# EAGLE schematic TwixBC (EAGLE 5.06)
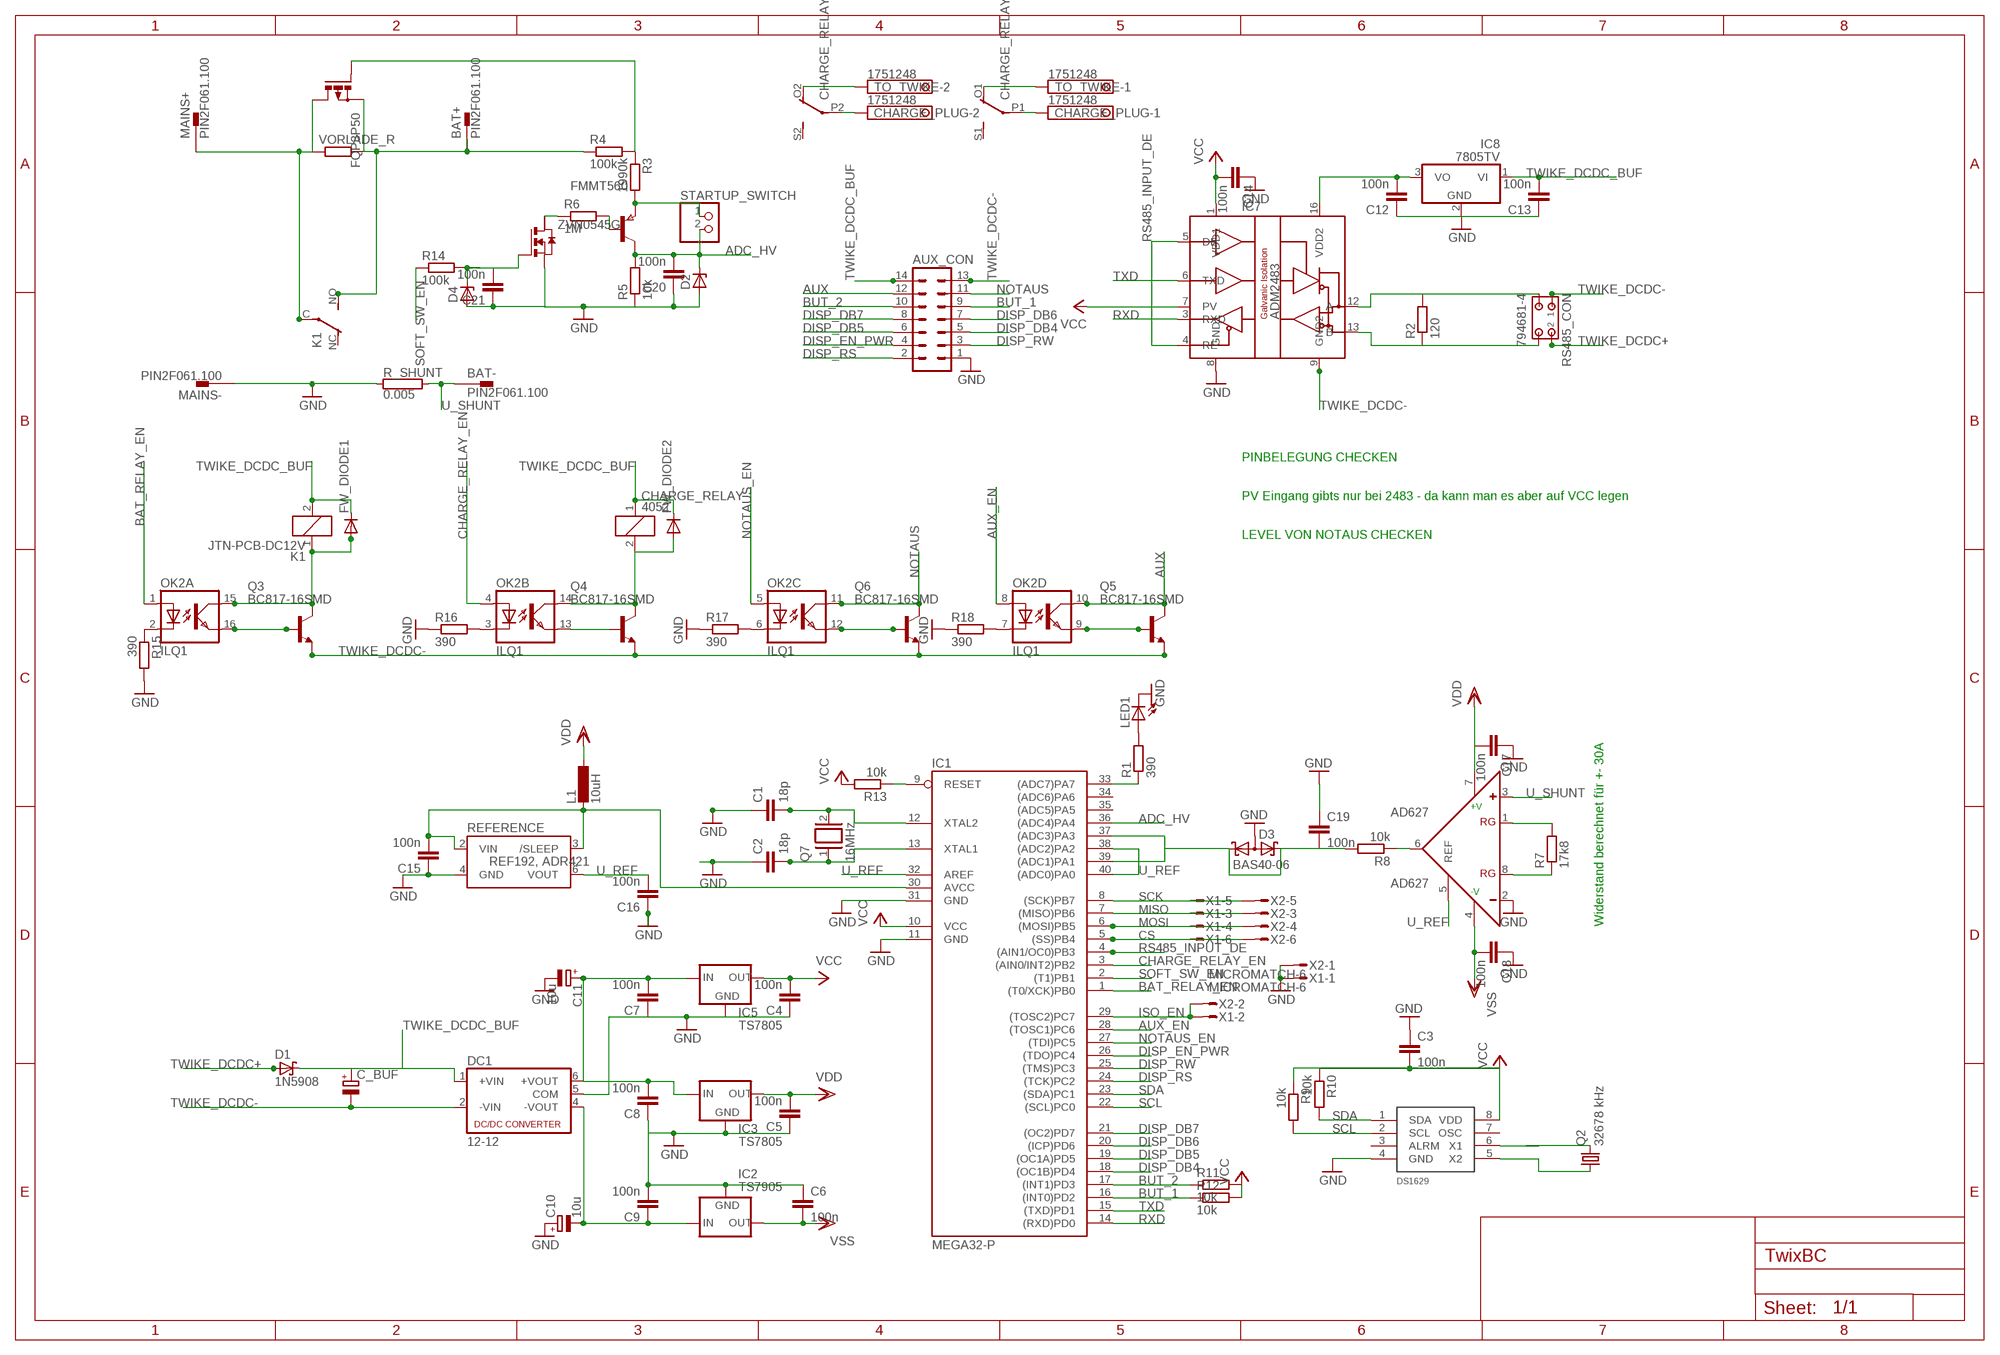
[diagram p0: schematic, sheet 1]

## Parts
AD627  AD627  AD620N  [DIL08]
AUX_CON  ML14  [ML14]
BAT+  PIN2F061.100  [F061.100]
BAT-  PIN2F061.100  [F061.100]
C1  18p  C-EUC1206  [C1206]
C2  18p  C-EUC1206  [C1206]
C3  100n  C-EUC1206  [C1206]
C4  100n  C-EUC1206  [C1206]
C5  100n  C-EUC1206  [C1206]
C6  100n  C-EUC1206  [C1206]
C7  100n  C-EUC1206  [C1206]
C8  100n  C-EUC1206  [C1206]
C9  100n  C-EUC1206  [C1206]
C10  10u  CPOL-EUE2.5-5  [E2,5-5]
C11  10u  CPOL-EUE2.5-5  [E2,5-5]
C12  100n  C-EUC1206  [C1206]
C13  100n  C-EUC1206  [C1206]
C14  100n  C-EUC1206  [C1206]
C15  100n  C-EUC1206  [C1206]
C16  100n  C-EUC1206  [C1206]
C17  100n  C-EUC1206  [C1206]
C18  100n  C-EUC1206  [C1206]
C19  100n  C-EUC1206  [C1206]
C20  100n  C-EUC1206  [C1206]
C21  100n  C-EUC1206  [C1206]
C_BUF  CPOL-EUE7.5-18  [E7,5-18]
CHARGE_PLUG  1751248  [1751248]
CHARGE_RELAY  4052  [F4052]
D1  1N5908  [C4111-15]
D2  ZENER-DIODESOD80C  [SOD80C]
D3  BAS40-06  [SOT23]
D4  ZENER-DIODESOD80C  [SOD80C]
DC1  12-12  NMA  [NMA]
FMMT560  PNPSOT23  [SOT-23]
FQP3P50  PMOSFET_PTO220BV  [TO220BV]
FW_DIODE1  DIODE-MINIMELF  [MINIMELF]
FW_DIODE2  DIODE-MINIMELF  [MINIMELF]
IC1  MEGA32-P  [DIL40]
IC2  TS7905  79XXS  [79XXS]
IC3  TS7805  78XXS  [78XXS]
IC5  TS7805  78XXS  [78XXS]
IC7  ADM2483  [SO16W]
IC8  7805TV  [TO220V]
K1  JTN-PCB-DC12V  [JT-PCB]
L1  10uH  L-EUL3225M  [L3225M]
LED1  LEDCHIP-LED0805  [CHIP-LED0805]
MAINS+  PIN2F061.100  [F061.100]
MAINS-  PIN2F061.100  [F061.100]
OK2  ILQ1  [DIL16]
Q2  32678 kHz  CRYSTALTC26V  [TC26V]
Q3  BC817-16SMD  [SOT23-BEC]
Q4  BC817-16SMD  [SOT23-BEC]
Q5  BC817-16SMD  [SOT23-BEC]
Q6  BC817-16SMD  [SOT23-BEC]
Q7  16MHz  XTAL/S  [QS]
R1  390  R-EU_M1206  [M1206]
R2  120  R-EU_M1206  [M1206]
R3  1990k  R-EU_M1206  [M1206]
R4  100k  R-EU_M1206  [M1206]
R5  10k  R-EU_M1206  [M1206]
R6  1M  R-EU_M1206  [M1206]
R7  17k8  R-EU_M1206  [M1206]
R8  10k  R-EU_M1206  [M1206]
R9  10k  R-EU_M1206  [M1206]
R10  10k  R-EU_M1206  [M1206]
R11  10k  R-EU_M1206  [M1206]
R12  10k  R-EU_M1206  [M1206]
R13  10k  R-EU_M1206  [M1206]
R14  100k  R-EU_M1206  [M1206]
R15  390  R-EU_M1206  [M1206]
R16  390  R-EU_M1206  [M1206]
R17  390  R-EU_M1206  [M1206]
R18  390  R-EU_M1206  [M1206]
R_SHUNT  0.005  RKH208-8  [KH208-8]
REFERENCE  REF192, ADR421  REF192  [SO08]
RS485_CON  794681-4  [794681-4]
STARTUP_SWITCH  PINHD-1X2  [1X02]
TO_TWIKE  1751248  [1751248]
U$2  DS1629  [S08]
VORLADE_R  R-EU_RDH/15  [RDH/15]
X1  MICROMATCH-6  [MICROMATCH-6]
X2  MICROMATCH-6  [MICROMATCH-6]
ZVN0545G  NMOSSOT223  [SOT223]

## Nets
ADC_HV: C20.2 D2.C FMMT560.1(C) IC1.36((ADC4)PA4) R5.2 STARTUP_SWITCH.2
AUX: AUX_CON.12 OK2.10(D:COL) Q5.C
AUX_EN: IC1.28((TOSC1)PC6) OK2.8(D:A)
BAT_RELAY_EN: IC1.1((T0/XCK)PB0) OK2.1(A:A)
BUT_1: AUX_CON.9 IC1.16((INT0)PD2) R12.1
BUT_2: AUX_CON.10 IC1.17((INT1)PD3) R11.1
CHARGE_RELAY_EN: IC1.3((AIN0/INT2)PB2) OK2.4(B:A)
CS: IC1.5((SS)PB4) X1.6 X2.6
DISP_DB4: AUX_CON.5 IC1.18((OC1B)PD4)
DISP_DB5: AUX_CON.6 IC1.19((OC1A)PD5)
DISP_DB6: AUX_CON.7 IC1.20((ICP)PD6)
DISP_DB7: AUX_CON.8 IC1.21((OC2)PD7)
DISP_EN_PWR: AUX_CON.4 IC1.26((TDO)PC4)
DISP_RS: AUX_CON.2 IC1.24((TCK)PC2)
DISP_RW: AUX_CON.3 IC1.25((TMS)PC3)
GND: AD627.2(-) AUX_CON.1 C1.1 C2.1 C3.1 C4.1 C5.1 C6.1 C7.1 C8.1 C9.2 C10.+ C11.- C12.1 C13.1 C14.1 C15.1 C16.1 C17.1 C18.1 C19.1 C20.1 C21.1 D2.A D3.3(AA) D4.A DC1.5(COM) IC1.11(GND) IC1.31(GND) IC2.GND IC3.GND IC5.GND IC7.8(GND1) IC8.2(GND) LED1.C MAINS-.A1 R5.1 R15.2 R16.1 R17.1 R18.1 R_SHUNT.1 REFERENCE.4(GND) U$2.4(GND) X1.1 X2.1 ZVN0545G.3(S)
ISO_EN: IC1.29((TOSC2)PC7) X1.2 X2.2
MAINS+: FQP3P50.D K1.C(P) MAINS+.A1 VORLADE_R.1
MISO: IC1.7((MISO)PB6) X1.3 X2.3
MOSI: IC1.6((MOSI)PB5) X1.4 X2.4
N$1: IC1.33((ADC7)PA7) R1.1
N$2: FMMT560.2(E) R3.2 STARTUP_SWITCH.1
N$3: FMMT560.3(B) R6.2
N$4: FQP3P50.G R3.1 R4.2
N$5: R6.1 ZVN0545G.2(D)
N$6: AD627.6(OUT) R8.1
N$7: C19.2 D3.1(K1) D3.2(K2) IC1.37((ADC3)PA3) IC1.39((ADC1)PA1) R8.2
N$8: C21.2 D4.C R14.2 ZVN0545G.1(G)
N$9: FW_DIODE1.A K1.1 OK2.15(A:COL) Q3.C
N$10: OK2.13(B:EMIT) Q4.B
N$11: OK2.2(A:C) R15.1
N$12: OK2.3(B:C) R16.2
N$13: OK2.6(C:C) R17.2
N$14: OK2.7(D:C) R18.2
N$18: C1.2 IC1.12(XTAL2) Q7.2
N$22: C2.2 IC1.13(XTAL1) Q7.1
N$24: BAT+.A1 BAT+.A2(1.1) FQP3P50.S K1.NO(S) R4.1 VORLADE_R.2
N$26: IC7.12(A) R2.2 RS485_CON.3
N$27: IC7.13(B) R2.1 RS485_CON.4
N$28: C12.2 IC7.16(VDD2) IC8.3(VO)
N$29: C15.2 IC1.30(AVCC) L1.2 REFERENCE.2(VIN) REFERENCE.3(/SLEEP)
N$31: C7.2 C8.2 C11.+ DC1.6(+VOUT) IC3.IN IC5.IN
N$32: C9.1 C10.- DC1.4(-VOUT) IC2.IN
N$33: AD627.1(RG) R7.2
N$34: AD627.8(RG) R7.1
N$38: IC1.9(RESET) R13.1
N$40: Q2.2 U$2.6(X1)
N$41: Q2.1 U$2.5(X2)
N$42: OK2.16(A:EMIT) Q3.B
N$45: CHARGE_PLUG.1 CHARGE_RELAY.P1(2:P)
N$46: CHARGE_PLUG.2 CHARGE_RELAY.P2(3:P)
N$47: CHARGE_RELAY.2 FW_DIODE2.A OK2.14(B:COL) Q4.C
N$48: CHARGE_RELAY.O1(2:O) TO_TWIKE.1
N$49: CHARGE_RELAY.O2(3:O) TO_TWIKE.2
N$53: LED1.A R1.2
N$54: OK2.9(D:EMIT) Q5.B
N$65: OK2.12(C:EMIT) Q6.B
NOTAUS: AUX_CON.11 OK2.11(C:COL) Q6.C
NOTAUS_EN: IC1.27((TDI)PC5) OK2.5(C:A)
RS485_INPUT_DE: IC1.4((AIN1/OC0)PB3) IC7.4(RE) IC7.5(DE)
RXD: IC1.14((RXD)PD0) IC7.3(RXD)
SCK: IC1.8((SCK)PB7) X1.5 X2.5
SCL: IC1.22((SCL)PC0) R9.2 U$2.2(SCL)
SDA: IC1.23((SDA)PC1) R10.2 U$2.1(SDA)
SOFT_SW_EN: IC1.2((T1)PB1) R14.1
TWIKE_DCDC+: D1.A RS485_CON.2
TWIKE_DCDC-: AUX_CON.13 C_BUF.- DC1.2(-VIN) IC7.9(GND2) Q3.E Q4.E Q5.E Q6.E RS485_CON.1
TWIKE_DCDC_BUF: AUX_CON.14 C13.2 C_BUF.+ CHARGE_RELAY.1 D1.C DC1.1(+VIN) FW_DIODE1.C FW_DIODE2.C IC8.1(VI) K1.2
TXD: IC1.15((TXD)PD1) IC7.6(TXD)
U_REF: AD627.5(REF) C16.2 IC1.32(AREF) IC1.38((ADC2)PA2) IC1.40((ADC0)PA0) REFERENCE.6(VOUT)
U_SHUNT: AD627.3(+) BAT-.A1 R_SHUNT.2
VCC: C3.2 C4.2 C14.2 IC1.10(VCC) IC5.OUT IC7.1(VDD1) IC7.7(PV) R9.1 R10.1 R11.2 R12.2 R13.2 U$2.8(VDD)
VDD: AD627.7(+V) C5.2 C17.2 IC3.OUT L1.1
VSS: AD627.4(-V) C6.2 C18.2 IC2.OUT
Unconnected: BAT-.A2(1.1) CHARGE_RELAY.S1(2:S) CHARGE_RELAY.S2(3:S) IC1.34((ADC6)PA6) IC1.35((ADC5)PA5) K1.NC(O) MAINS+.A2(1.1) MAINS-.A2(1.1) U$2.3(ALRM) U$2.7(OSC) ZVN0545G.4(D2)

## Notes on the sheet
- PINBELEGUNG CHECKEN
- PV Eingang gibts nur bei 2483 - da kann man es aber auf VCC legen
- LEVEL VON NOTAUS CHECKEN
- Widerstand berechnet für +- 30A

## Library data of the parts
AD627 = analog-devices:AD620: Low Cost, Low Power, Instrumentation Amplifier Source: http://www.analog.com/UploadedFiles/Data_Sheets/37793330023930AD620_e.pdf
AUX_CON = con-ml:ML14: HARTING
BAT+ BAT- MAINS+ MAINS- = con-faston:PIN2: Flachstecker Typ Tyco/Electronics/AMP TAB, FASTON Printed Circuit Board Tabs Source: http://www.buerklin.com, http://catalog.tycoelectronics.com
C1-C9 C12-C21 = rcl:C-EU: CAPACITOR, European symbol
C10 C11 C_BUF = rcl:CPOL-EU: POLARIZED CAPACITOR, European symbol
CHARGE_PLUG TO_TWIKE = con-phoenix-350:1751248: MKDS 1/ 2-3,5 Printklemme Nennstrom: 10 A Bemessungsspannung: 160 V Raster: 3,5 mm Polzahl: 2 Montageart: Löten Anschlussart: Schraubanschluss Anschlussrichtung vom Leiter zur Platine: 0° Source: http://eshop.phoenixcontact.com .. 1751248.pdf
CHARGE_RELAY = relay:4052: RELAY 2 x switch, Finder
D1 = diode:1N5908: DIODE schottky
D2 D4 = diode:ZENER-DIODE: Z-Diode
D3 = diode:BAS40-06: Silicon Schottky Diodes General-purpose diode for high-speed switching
DC1 = dc-dc-converter:NMA: DC-DC CONVERTER
FMMT560 = zetex:PNPSOT23: PNP TRANSISTOR
FQP3P50 = transistor-power:PMOSFET_P: Power MOSFET P-Channel
FW_DIODE1 FW_DIODE2 = diode:DIODE-: DIODE
IC1 = atmel:MEGA32-P: MICROCONTROLLER 32 Kbytes FLASH 2 Kbytes SRAM 1 Kbytes EEPROM USART 8-channel 10 bit ADC Source: www.atmel.com .. doc2503.pdf
IC2 = v-reg:79XXS: VOLTAGE REGULATOR
IC3 IC5 = v-reg:78XXS: VOLTAGE REGULATOR
IC7 = Libs_Markus:ADM2483: RS-485 Transceiver, iCoupler® Isolated, Half-Duplex
IC8 = linear:78*: Positive VOLTAGE REGULATOR Source: http://cache.national.com/ds/LM/LM78L05.pdf http://www.fairchildsemi.com/ds/LM/LM7805.pdf
K1 = relay:JT?-*: COMPACT ECONOMICAL 30 AMP. RELAY NAiS Source: http://www.mew-europe.com/.. en_ds_61212_0000.pdf
L1 = rcl:L-EU: INDUCTOR, European symbol
LED1 = led:LED: LED OSRAM: - CHIPLED LG R971, LG N971, LY N971, LG Q971, LY Q971, LO R971, LY R971 LH N974, LH R974 LS Q976, LO Q976, LY Q976 LO Q996 - Hyper CHIPLED LW Q18S LB Q993, LB Q99A, LB R99A - SideLED LS A670, LO A670, LY A670, LG A670, LP A670 LB A673, LV A673, LT A673, LW A673 LH A674 LY A675 LS A676, LA A676, LO A676, LY A676, LW A676 LS A679, LY A679, LG A679 - Hyper Micro SIDELED® LS Y876, LA Y876, LO Y876, LY Y876 LT Y87S - SmartLED LW L88C, LW L88S LB L89C, LB L89S, LG L890 LS L89K, LO L89K, LY L89K LS L896, LA L896, LO L896, LY L896 - TOPLED LS T670, LO T670, LY T670, LG T670, LP T670 LSG T670, LSP T670, LSY T670, LOP T670, LYG T670 LG T671, LOG T671, LSG T671 LB T673, LV T673, LT T673, LW T673 LH T674 LS T676, LA T676, LO T676, LY T676, LB T676, LH T676, LSB T676, LW T676 LB T67C, LV T67C, LT T67C, LS T67K, LO T67K, LY T67K, LW E67C LS E67B, LA E67B, LO E67B, LY E67B, LB E67C, LV E67C, LT E67C LW T67C LS T679, LY T679, LG T679 LS T770, LO T770, LY T770, LG T770, LP T770 LB T773, LV T773, LT T773, LW T773 LH T774 LS E675, LA E675, LY E675, LS T675 LS T776, LA T776, LO T776, LY T776, LB T776 LHGB T686 LT T68C, LB T68C - Hyper Mini TOPLED® LB M676 - Mini TOPLED Santana® LG M470 LS M47K, LO M47K, LY M47K Source: http://www.osram.convergy.de LUXEON: - LUMILED® LXK2-PW12-R00, LXK2-PW12-S00, LXK2-PW14-U00, LXK2-PW14-V00 LXK2-PM12-R00, LXK2-PM12-S00, LXK2-PM14-U00 LXK2-PE12-Q00, LXK2-PE12-R00, LXK2-PE12-S00, LXK2-PE14-T00, LXK2-PE14-U00 LXK2-PB12-K00, LXK2-PB12-L00, LXK2-PB12-M00, LXK2-PB14-N00, LXK2-PB14-P00, LXK2-PB14-Q00 LXK2-PR12-L00, LXK2-PR12-M00, LXK2-PR14-Q00, LXK2-PR14-R00 LXK2-PD12-Q00, LXK2-PD12-R00, LXK2-PD12-S00 LXK2-PH12-R00, LXK2-PH12-S00 LXK2-PL12-P00, LXK2-PL12-Q00, LXK2-PL12-R00 Source: www.luxeon.com KINGBRIGHT: KA-3528ASYC Source: www.kingbright.com
OK2 = optocoupler:ILQ1: SIEMENS OPTO COUPLER
Q2 = crystal:CRYSTAL: CRYSTAL
Q3-Q6 = transistor-npn:BC817*: NPN Transistor
Q7 = special:XTAL/S: CRYSTAL
R1-R18 VORLADE_R = rcl:R-EU_: RESISTOR, European symbol
R_SHUNT = resistor-power:R: Power Resitor
REFERENCE = Libs_Markus:REF192
RS485_CON = con-amp:794681-4: Micro MATE-N-LOK Connectors grid 1.5mm Dual Row Through Hole Vertical Metal Through Hole Holddowns Source: ENG_CD_794681_E.pdf
STARTUP_SWITCH = pinhead:PINHD-1X2: PIN HEADER
U$2 = DS1629:DS1629
X1 X2 = con-amp-micromatch:MICROMATCH-6: MicroMaTch 6 7-215464-6 / 0-215464-6 Drawing Number C-215464 DDEController.pdf
ZVN0545G = zetex:NMOSSOT223: MOS FET